# Altium schematic sheet SoC_Supply.SchDoc: RFSoC AMC
size 420 x 297 mm; CompanyName: WUT; DrawnBy: T. Przywozki; Organization: WUT ISE; Address1: Warsaw University of Technology; Address2: Nowowiejska 15/19 00-665 Warsaw; Address3: Tomasz.Przywozki@pw.edu.pl; DocumentNumber: 12; Revision: 1; SheetNumber: 12; SheetTotal: 45; Project: RFSoC AMC; ModifiedBy: T. Przywozki; CreateDate: -; CheckedDate: -; DivGrp: ISE; Designer: T. Przywozki; ModifiedDate: -; ProjectName: ADC/DAC MEZZANINE
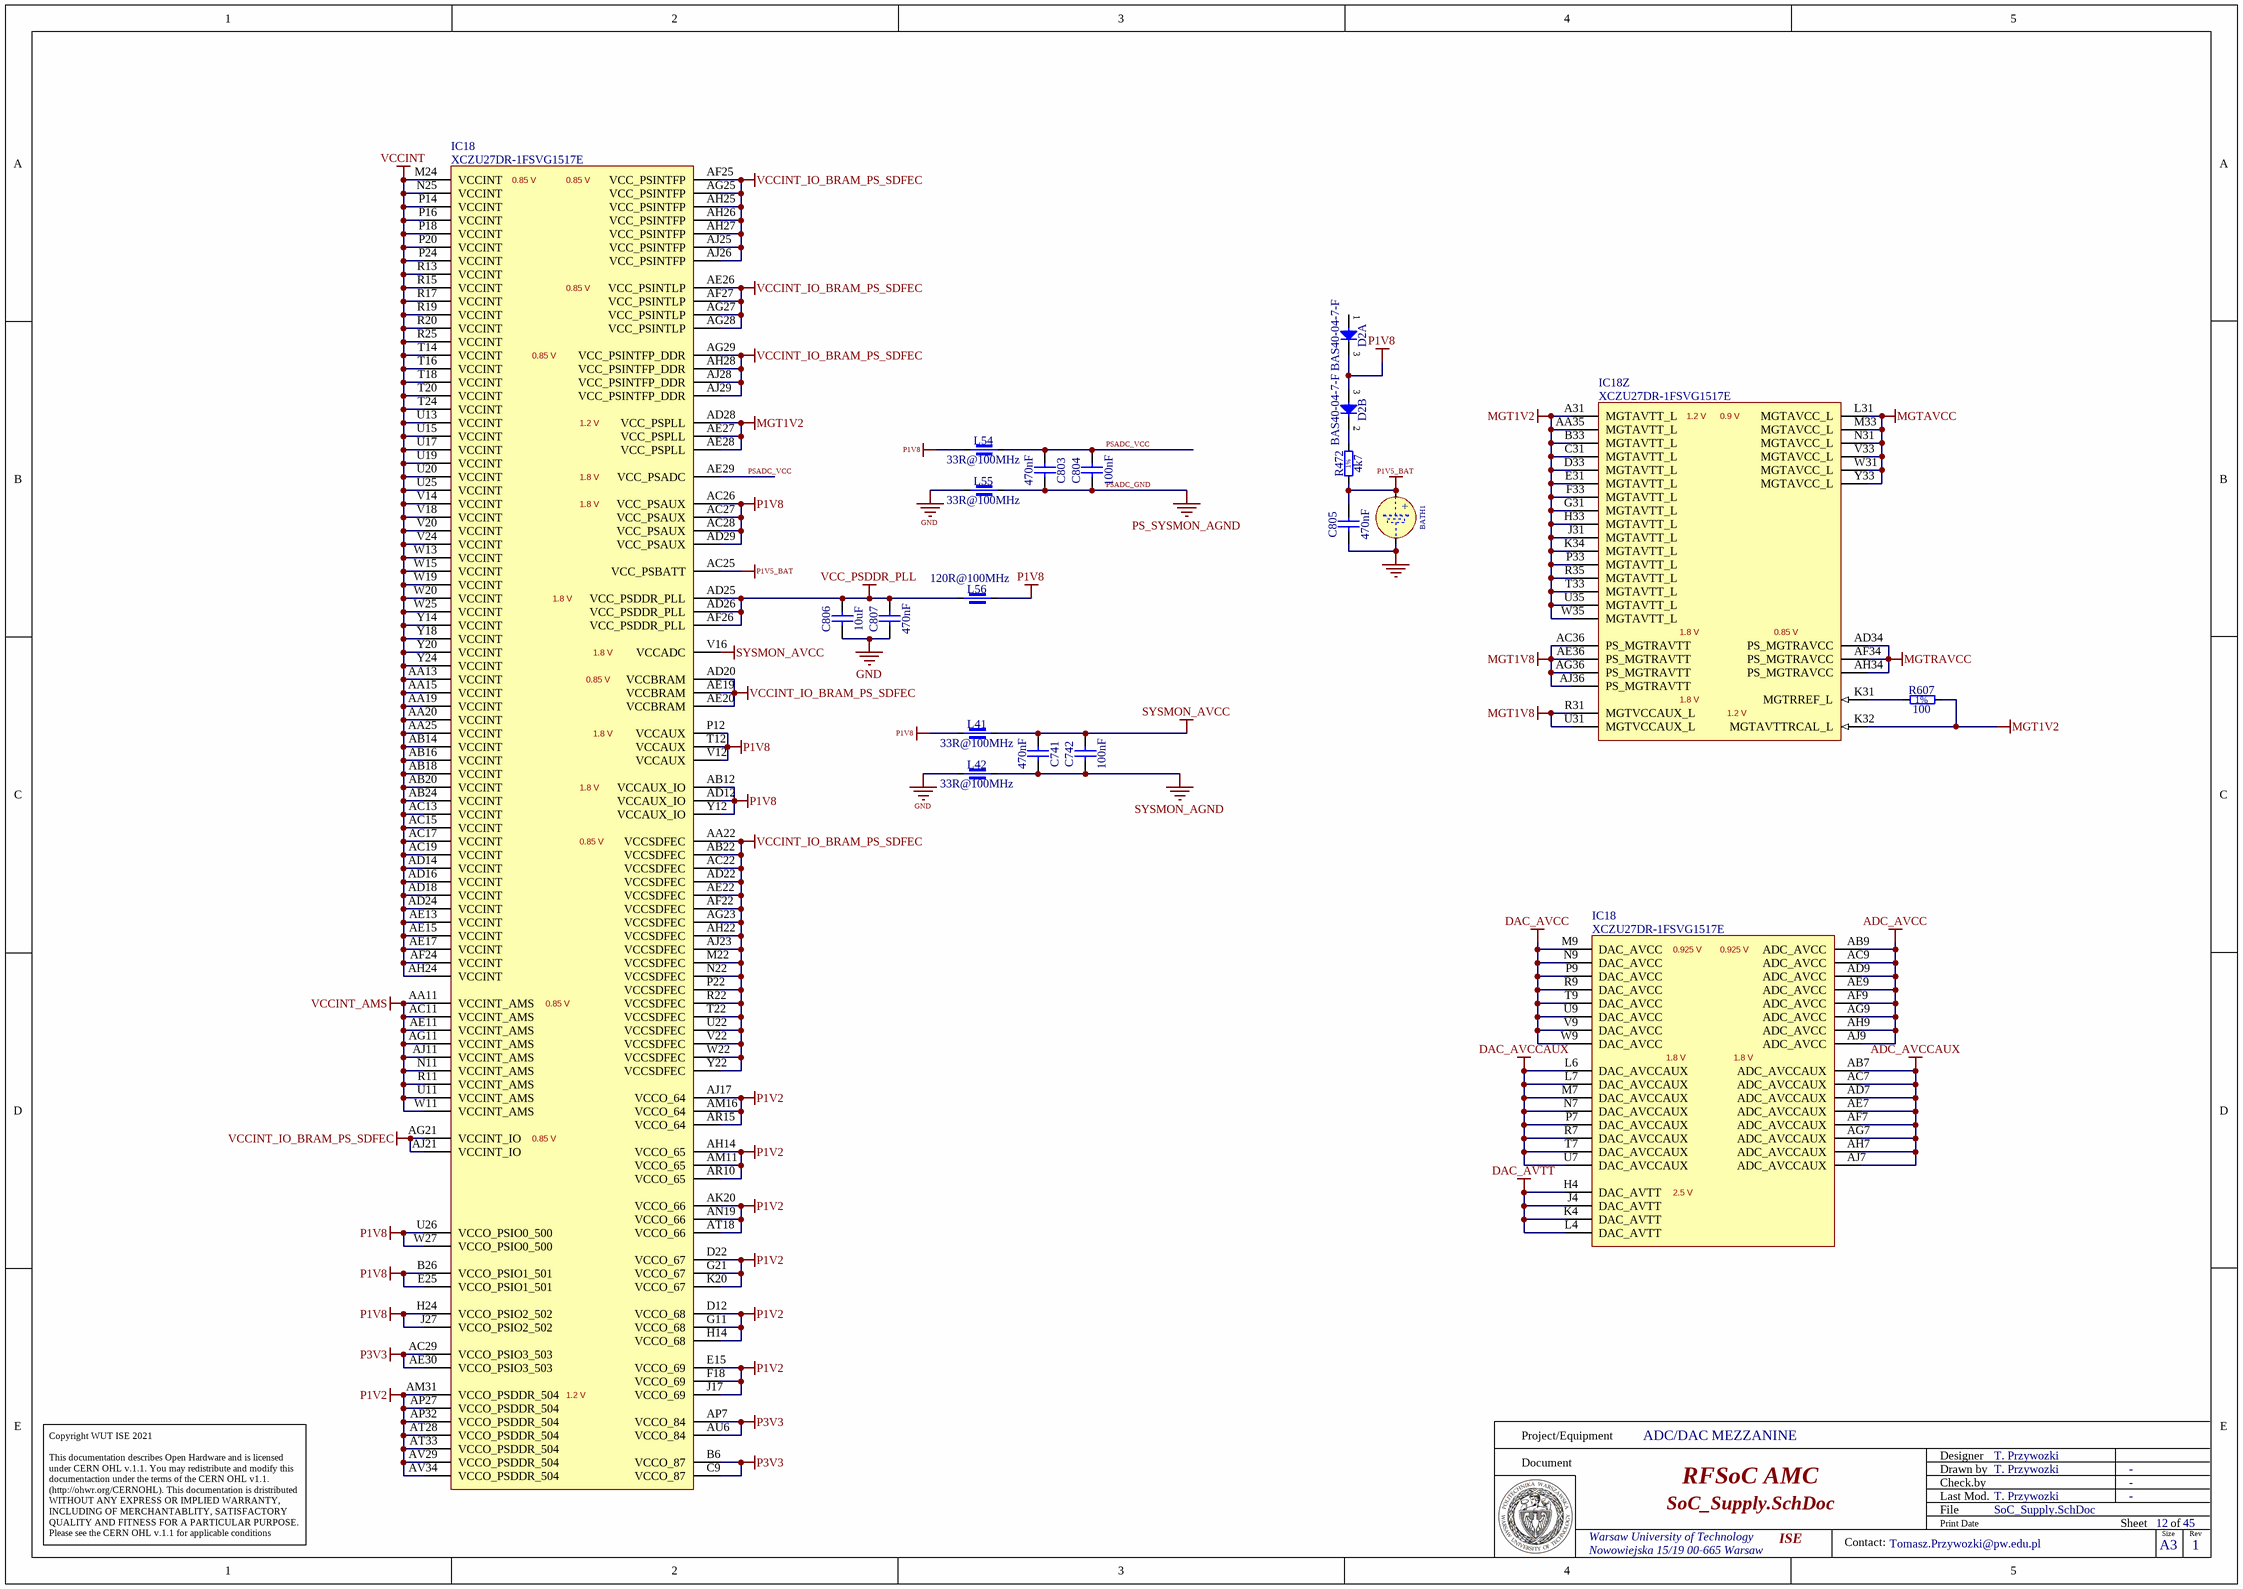
[diagram p0: SoC_Supply.SchDoc]

## Parts
BATH1  (no value)  [BATH_KEYSTONE_2998]
C741  470nF  [CAPC0603X33N]
C742  100nF  [CAPC1005X55N]
C803  470nF  [CAPC0603X33N]
C804  100nF  [CAPC1005X55N]
C805  470nF  [CAPC0603X33N]
C806  10uF  [CAPC1608X80N]
C807  470nF  [CAPC1005X55N]
D2  BAS40-04-7-F  [SOT95P240X110-3N]  (parts A,B of 2)
IC18  XCZU27DR-1FSVG1517E  [XILINX_FSVG1517 (XCZU27DR)]  (parts Z,27,28 of 31)
L41  33R@100MHz  [INDC1005X55N]
L42  33R@100MHz  [INDC1005X55N]
L54  33R@100MHz  [INDC1005X55N]
L55  33R@100MHz  [INDC1005X55N]
L56  120R@100MHz  [INDC1608X95N]
R472  4k7  [RESC1005X40N]
R607  100  [RESC1005X40N]

## Nets
ADC_AVCC: IC18.AB9(ADC_AVCC) IC18.AC9(ADC_AVCC) IC18.AD9(ADC_AVCC) IC18.AE9(ADC_AVCC) IC18.AF9(ADC_AVCC) IC18.AG9(ADC_AVCC) IC18.AH9(ADC_AVCC) IC18.AJ9(ADC_AVCC)
ADC_AVCCAUX: IC18.AB7(ADC_AVCCAUX) IC18.AC7(ADC_AVCCAUX) IC18.AD7(ADC_AVCCAUX) IC18.AE7(ADC_AVCCAUX) IC18.AF7(ADC_AVCCAUX) IC18.AG7(ADC_AVCCAUX) IC18.AH7(ADC_AVCCAUX) IC18.AJ7(ADC_AVCCAUX)
DAC_AVCC: IC18.M9(DAC_AVCC) IC18.N9(DAC_AVCC) IC18.P9(DAC_AVCC) IC18.R9(DAC_AVCC) IC18.T9(DAC_AVCC) IC18.U9(DAC_AVCC) IC18.V9(DAC_AVCC) IC18.W9(DAC_AVCC)
DAC_AVCCAUX: IC18.L6(DAC_AVCCAUX) IC18.L7(DAC_AVCCAUX) IC18.M7(DAC_AVCCAUX) IC18.N7(DAC_AVCCAUX) IC18.P7(DAC_AVCCAUX) IC18.R7(DAC_AVCCAUX) IC18.T7(DAC_AVCCAUX) IC18.U7(DAC_AVCCAUX)
DAC_AVTT: IC18.H4(DAC_AVTT) IC18.J4(DAC_AVTT) IC18.K4(DAC_AVTT) IC18.L4(DAC_AVTT)
GND: BATH1.2(MINUS) C805.1 C806.1 C807.1 L42.1 L55.1
MGT1V2: IC18.A31(MGTAVTT_L) IC18.AA35(MGTAVTT_L) IC18.AD28(VCC_PSPLL) IC18.AE27(VCC_PSPLL) IC18.AE28(VCC_PSPLL) IC18.B33(MGTAVTT_L) IC18.C31(MGTAVTT_L) IC18.D33(MGTAVTT_L) IC18.E31(MGTAVTT_L) IC18.F33(MGTAVTT_L) IC18.G31(MGTAVTT_L) IC18.H33(MGTAVTT_L) IC18.J31(MGTAVTT_L) IC18.K32(MGTAVTTRCAL_L) IC18.K34(MGTAVTT_L) IC18.P33(MGTAVTT_L) IC18.R35(MGTAVTT_L) IC18.T33(MGTAVTT_L) IC18.U35(MGTAVTT_L) IC18.W35(MGTAVTT_L) R607.2
MGT1V8: IC18.AC36(PS_MGTRAVTT) IC18.AE36(PS_MGTRAVTT) IC18.AG36(PS_MGTRAVTT) IC18.AJ36(PS_MGTRAVTT) IC18.R31(MGTVCCAUX_L) IC18.U31(MGTVCCAUX_L)
MGTAVCC: IC18.L31(MGTAVCC_L) IC18.M33(MGTAVCC_L) IC18.N31(MGTAVCC_L) IC18.V33(MGTAVCC_L) IC18.W31(MGTAVCC_L) IC18.Y33(MGTAVCC_L)
MGTRAVCC: IC18.AD34(PS_MGTRAVCC) IC18.AF34(PS_MGTRAVCC) IC18.AH34(PS_MGTRAVCC)
P1V2: IC18.AH14(VCCO_65) IC18.AJ17(VCCO_64) IC18.AK20(VCCO_66) IC18.AM11(VCCO_65) IC18.AM16(VCCO_64) IC18.AM31(VCCO_PSDDR_504) IC18.AN19(VCCO_66) IC18.AP27(VCCO_PSDDR_504) IC18.AP32(VCCO_PSDDR_504) IC18.AR10(VCCO_65) IC18.AR15(VCCO_64) IC18.AT18(VCCO_66) IC18.AT28(VCCO_PSDDR_504) IC18.AT33(VCCO_PSDDR_504) IC18.AV29(VCCO_PSDDR_504) IC18.AV34(VCCO_PSDDR_504) IC18.D12(VCCO_68) IC18.D22(VCCO_67) IC18.E15(VCCO_69) IC18.F18(VCCO_69) IC18.G11(VCCO_68) IC18.G21(VCCO_67) IC18.H14(VCCO_68) IC18.J17(VCCO_69) IC18.K20(VCCO_67)
P1V5_BAT: BATH1.1(PLUS) C805.2 IC18.AC25(VCC_PSBATT) R472.1
P1V8: D2.3(COMAC) IC18.AB12(VCCAUX_IO) IC18.AC26(VCC_PSAUX) IC18.AC27(VCC_PSAUX) IC18.AC28(VCC_PSAUX) IC18.AD12(VCCAUX_IO) IC18.AD29(VCC_PSAUX) IC18.B26(VCCO_PSIO1_501) IC18.E25(VCCO_PSIO1_501) IC18.H24(VCCO_PSIO2_502) IC18.J27(VCCO_PSIO2_502) IC18.P12(VCCAUX) IC18.T12(VCCAUX) IC18.U26(VCCO_PSIO0_500) IC18.V12(VCCAUX) IC18.W27(VCCO_PSIO0_500) IC18.Y12(VCCAUX_IO) L41.1 L54.1 L56.1
P3V3: IC18.AC29(VCCO_PSIO3_503) IC18.AE30(VCCO_PSIO3_503) IC18.AP7(VCCO_84) IC18.AU6(VCCO_84) IC18.B6(VCCO_87) IC18.C9(VCCO_87)
PSADC_GND: C803.1 C804.1 L55.2  [also labelled PS_SYSMON_AGND]
SYSMON_AGND: C741.1 C742.1 L42.2
SYSMON_AVCC: C741.2 C742.2 IC18.V16(VCCADC) L41.2
VCC_PSDDR_PLL: C806.2 C807.2 IC18.AD25(VCC_PSDDR_PLL) IC18.AD26(VCC_PSDDR_PLL) IC18.AF26(VCC_PSDDR_PLL) L56.2
VCCINT: IC18.AA13(VCCINT) IC18.AA15(VCCINT) IC18.AA19(VCCINT) IC18.AA20(VCCINT) IC18.AA25(VCCINT) IC18.AB14(VCCINT) IC18.AB16(VCCINT) IC18.AB18(VCCINT) IC18.AB20(VCCINT) IC18.AB24(VCCINT) IC18.AC13(VCCINT) IC18.AC15(VCCINT) IC18.AC17(VCCINT) IC18.AC19(VCCINT) IC18.AD14(VCCINT) IC18.AD16(VCCINT) IC18.AD18(VCCINT) IC18.AD24(VCCINT) IC18.AE13(VCCINT) IC18.AE15(VCCINT) IC18.AE17(VCCINT) IC18.AF24(VCCINT) IC18.AH24(VCCINT) IC18.M24(VCCINT) IC18.N25(VCCINT) IC18.P14(VCCINT) IC18.P16(VCCINT) IC18.P18(VCCINT) IC18.P20(VCCINT) IC18.P24(VCCINT) IC18.R13(VCCINT) IC18.R15(VCCINT) IC18.R17(VCCINT) IC18.R19(VCCINT) IC18.R20(VCCINT) IC18.R25(VCCINT) IC18.T14(VCCINT) IC18.T16(VCCINT) IC18.T18(VCCINT) IC18.T20(VCCINT) IC18.T24(VCCINT) IC18.U13(VCCINT) IC18.U15(VCCINT) IC18.U17(VCCINT) IC18.U19(VCCINT) IC18.U20(VCCINT) IC18.U25(VCCINT) IC18.V14(VCCINT) IC18.V18(VCCINT) IC18.V20(VCCINT) IC18.V24(VCCINT) IC18.W13(VCCINT) IC18.W15(VCCINT) IC18.W19(VCCINT) IC18.W20(VCCINT) IC18.W25(VCCINT) IC18.Y14(VCCINT) IC18.Y18(VCCINT) IC18.Y20(VCCINT) IC18.Y24(VCCINT)
VCCINT_AMS: IC18.AA11(VCCINT_AMS) IC18.AC11(VCCINT_AMS) IC18.AE11(VCCINT_AMS) IC18.AG11(VCCINT_AMS) IC18.AJ11(VCCINT_AMS) IC18.N11(VCCINT_AMS) IC18.R11(VCCINT_AMS) IC18.U11(VCCINT_AMS) IC18.W11(VCCINT_AMS)
VCCINT_IO_BRAM_PS_SDFEC: IC18.AA22(VCCSDFEC) IC18.AB22(VCCSDFEC) IC18.AC22(VCCSDFEC) IC18.AD20(VCCBRAM) IC18.AD22(VCCSDFEC) IC18.AE19(VCCBRAM) IC18.AE20(VCCBRAM) IC18.AE22(VCCSDFEC) IC18.AE26(VCC_PSINTLP) IC18.AF22(VCCSDFEC) IC18.AF25(VCC_PSINTFP) IC18.AF27(VCC_PSINTLP) IC18.AG21(VCCINT_IO) IC18.AG23(VCCSDFEC) IC18.AG25(VCC_PSINTFP) IC18.AG27(VCC_PSINTLP) IC18.AG28(VCC_PSINTLP) IC18.AG29(VCC_PSINTFP_DDR) IC18.AH22(VCCSDFEC) IC18.AH25(VCC_PSINTFP) IC18.AH26(VCC_PSINTFP) IC18.AH27(VCC_PSINTFP) IC18.AH28(VCC_PSINTFP_DDR) IC18.AJ21(VCCINT_IO) IC18.AJ23(VCCSDFEC) IC18.AJ25(VCC_PSINTFP) IC18.AJ26(VCC_PSINTFP) IC18.AJ28(VCC_PSINTFP_DDR) IC18.AJ29(VCC_PSINTFP_DDR) IC18.M22(VCCSDFEC) IC18.N22(VCCSDFEC) IC18.P22(VCCSDFEC) IC18.R22(VCCSDFEC) IC18.T22(VCCSDFEC) IC18.U22(VCCSDFEC) IC18.V22(VCCSDFEC) IC18.W22(VCCSDFEC) IC18.Y22(VCCSDFEC)
PSADC_VCC: C803.2 C804.2 IC18.AE29(VCC_PSADC) L54.2
NetD2_2: D2.2(C) R472.2
NetIC18_K31: IC18.K31(MGTRREF_L) R607.1

Not connected (* = marked no-connect by the designer): D2 1(A)

## Notes on the sheet
- (near IC18) 0.85 V
- (near IC18) 1.2 V
- (near IC18) 0.9 V
- (near IC18) 1.8 V
- (near IC18) 0.925 V
- (near IC18) 2.5 V
- Project/Equipment
- Document
- Designer
- Drawn by
- Check.by
- Copyright WUT ISE 2021
  This documentation describes Open Hardware and is licensed under CERN OHL v.1.1. You may redistribute and modify this documentaction under the terms of the CERN OHL v1.1.
  (http://ohwr.org/CERNOHL). This documentation is dristributed WITHOUT ANY EXPRESS OR IMPLIED WARRANTY, INCLUDING OF MERCHANTABLITY, SATISFACTORY QUALITY AND FITNESS FOR A PARTICULAR PURPOSE. Please see the CERN OHL v.1.1 for applicable conditions
- File
- Last Mod.
- Print Date
- Sheet
- Size
- A3
- of
- Rev
- Contact:
- (in symbol BATH_KEYSTONE_2998) +
- (in symbol R0402_4K7_1%_0.0625W_100PPM) 1%
- (in symbol R0402_100R_1%_0.1W_100PPM) 1%

## Library data of the parts
BATH1 = BATH_KEYSTONE_2998: Battery Holder whit 2 Pin; Part Description: SMD Battery Holder for MC621, V364, SC621, DR13H, DR77, V13AT, 377 Button Cells; Manufacturer Part Number: 2998; PressFit: No; Part Number: BATH_KEYSTONE_2998; Component Kind: Standard; Component Type: Standard; Pin Count: 3; PackageDescription: SMD Battery Holder for MC621, V364, SC621, DR13H, DR77, V13AT, 377 Button Cells; Family: Battery; Mounted: Yes; Socket: No; SMD: Yes; Sense: No; Manufacturer: KEYSTONE; ComponentHeight: 3.048mm; HelpURL: \\cern.ch\dfs\Applications\Altium\Datasheets\BATH_KEYSTONE_2998.pdf; Author: CERN DEM JLC; CreateDate: 03.07.2014; LatestRevisionDate: 07.06.2017
C741 C803 C805 = CC0201_470NF_4V_20%_X5R: Non-polarised capacitor; Manufacturer: GENERIC; Part Description: SMD Multilayer Chip Ceramic Capacitor; Manufacturer1 Part Number: AMK063BJ474MP-F; Tolerance: ±20%; Voltage: 4V; TC: X5R; Manufacturer Part Number: CC0201_470NF_4V_20%_X5R; Part Number: CC0201_470NF_4V_20%_X5R; Value: 470nF; Component Kind: Standard; Component Type: Standard; Pin Count: 2; Status: Not Recommended; Case: 0201; Mounted: Yes; Socket: No; SMD: Yes; Sense: No; Manufacturer1 Example: TAIYO YUDEN; Manufacturer1 ComponentHeight: 0.33mm; HelpURL: \\cern.ch\dfs\Applications\Altium\Datasheets\CC0201_X5R_TAIYO-YUDEN_STANDARD-CLASS2.pdf; Author: CERN DEM JLC; CreateDate: 27.05.2010; LatestRevisionDate: 27.05.2010
C742 C804 = CC0402_100NF_25V_10%_X7R_YUDEN_TMK105B7104KVHF: Non-polarised capacitor; Part Description: SMD Multilayer Chip Ceramic Capacitor (High Dielectric Type) for Automotive / Industrial Applications; Manufacturer: TAIYO YUDEN; Voltage: 25V; TC: X7R; Tolerance: ±10%; Part Number: CC0402_100NF_25V_10%_X7R_YUDEN_TMK105B7104KVHF; Component Kind: Standard; Component Type: Standard; Pin Count: 2; Value: 100nF; Status: Not Recommended; Manufacturer Part Number: TMK105B7104KVHF; Case: 0402; Mounted: Yes; Socket: No; SMD: Yes; Sense: No; ComponentHeight: 0.55mm; HelpURL: \\cern.ch\dfs\Applications\Altium\Datasheets\CC0402_TAIYO-YUDEN_TMK105B7104KVHF.pdf; Author: CERN DEM JLC; CreateDate: 10.05.2017; LatestRevisionDate: 10.05.2017
C806 = CC0603_10UF_10V_10%_X5R: Non-polarised capacitor; Part Description: SMD Multilayer Chip Ceramic Capacitor; Manufacturer: GENERIC; Manufacturer1 Part Number: GRM188R61A106KE69D; Voltage: 10V; TC: X5R; Tolerance: ±10%; Part Number: CC0603_10UF_10V_10%_X5R; Component Kind: Standard; Component Type: Standard; Pin Count: 2; Value: 10uF; Status: None; Manufacturer Part Number: CC0603_10UF_10V_10%_X5R; Case: 0603; Mounted: Yes; Socket: No; SMD: Yes; Sense: No; Manufacturer1 Example: MURATA; Manufacturer1 ComponentHeight: 0.8mm; HelpURL: \\cern.ch\dfs\Applications\Altium\Datasheets\CC0603_MURATA_GRM188R61A106KE69D.pdf; Author: CERN DEM JLC; CreateDate: 31.01.2017; LatestRevisionDate: 31.01.2017
C807 = CC0402_470NF_16V_10%_X5R: Non-polarised capacitor; Part Description: SMD Multilayer Chip Ceramic Capacitor; Manufacturer: GENERIC; Manufacturer1 Part Number: C1005X5R1C105KT; Voltage: 16V; TC: X5R; Tolerance: ±10%; Part Number: CC0402_470NF_16V_10%_X5R; Component Kind: Standard; Component Type: Standard; Pin Count: 2; Value: 470nF; Status: Preferred; Manufacturer Part Number: CC0402_470NF_16V_10%_X5R; Case: 0402; Mounted: Yes; Socket: No; SMD: Yes; Sense: No; Manufacturer1 Example: TDK; Manufacturer1 ComponentHeight: 0.55mm; HelpURL: \\cern.ch\dfs\Applications\Altium\Datasheets\CC0402_X5R_TDK_C.pdf; Author: CERN DEM JLC; CreateDate: 25.10.2012; LatestRevisionDate: 25.10.2012
D2 = BAS40-04-7-F: Serial Diode; Part Description: Dual Series Surface Mount Schottky Barrier Diodes; Manufacturer: DIODES INCORPORATED; Voltage: 40V; Power: 200mA; PressFit: No; Bonding: No; Part Number: BAS40-04-7-F; Component Kind: Standard; Component Type: Standard; Device: BAS40-04-7-F; PackageDescription: SOT, 0.95mm Pitch; 3 Pin, 1.30mm W X 2.90mm L X 1.10mm H, IPC Medium Density; Manufacturer Part Number: BAS40-04-7-F; Pin Count: 3; Case: SOT23-3; Mounted: Yes; Socket: No; SMD: Yes; Sense: No; ComponentHeight: 1.1mm; HelpURL: \\cern.ch\dfs\Applications\Altium\Datasheets\BAS40-04-7-F.pdf; Author: CERN DEM JLC; CreateDate: 07.07.2014; LatestRevisionDate: 07.07.2014
IC18 = XCZU27DR-1FSVG1517E: Zynq UltraScale+ RFSoC, Quad-Core ARM® Cortex™-A53 MPCore™ up to 1.5GHz, 214 PS I/O, 299 HP I/O, 48 HD I/O, 1517-Pin BGA; Manufacturer: XILINX; PressFit: No; Bonding: No; Part Number: XCZU27DR-1FSVG1517E; Component Kind: Standard; Component Type: Standard; Device: XCZU27DR-1FSVG1517E; PackageDescription: BGA, 1.00mm Pitch, Square; 1517 Pin, 39 Columns X 39 Rows, 40.00mm X 40.00mm X 4.01mm H; Part Description: Zynq UltraScale+ RFSoC, Quad-Core ARM® Cortex™-A53 MPCore™ up to 1.5GHz, 214 PS I/O, 299 HP I/O, 48 HD I/O, 1517-Pin BGA; Manufacturer Part Number: XCZU27DR-1FSVG1517E; Pin Count: 1517; Case: BGA1517; Mounted: Yes; Socket: No; SMD: Yes; Sense: No; ComponentHeight: 4.01mm; HelpURL: \\cern.ch\dfs\Applications\Altium\Datasheets\XCZU27DR-1FSVG1517E.pdf; ComponentLink1URL: \\cern.ch\dfs\Applications\Altium\Datasheets\XCZU27DR-1FSVG1517E_Package-Pinout.pdf; ComponentLink1Description: Package/Pinout; ComponentLink2URL: \\cern.ch\dfs\Applications\Altium\Datasheets\XCZU27DR-1FSVG1517E_Pinout.pdf; ComponentLink2Description: Pinout; Author: CERN DEM MR; CreateDate: 02/05/2018; LatestRevisionDate: 02/05/2018
L41 L42 L54 L55 = IND0402_MURATA_BLM15PX330SN1D: Manufacturer: MURATA; Part Description: SMD EMIFIL Chip Ferrite Bead; Tolerance: ±25%; Power: 3A; Resistance: 0.022R; Manufacturer Part Number: BLM15PX330SN1D; Part Number: IND0402_MURATA_BLM15PX330SN1D; Value: 33R@100MHz; Component Kind: Standard; Component Type: Standard; Pin Count: 2; Status: None; Case: 0402; Mounted: Yes; Socket: No; SMD: Yes; Sense: No; ComponentHeight: 0.55mm; HelpURL: \\cern.ch\dfs\Applications\Altium\Datasheets\IND0402_MURATA_BLM15PX.pdf; Author: CERN DEM JMW; CreateDate: 19.02.2014; LatestRevisionDate: 25.10.2018
L56 = IND0603_MURATA_BLM18PG121SN1D: Manufacturer: MURATA; Part Description: SMD EMIFIL Chip Ferrite Bead; Power: 2A; Resistance: 0.05R; Manufacturer Part Number: BLM18PG121SN1D; Part Number: IND0603_MURATA_BLM18PG121SN1D; Value: 120R@100MHz; Component Kind: Standard; Component Type: Standard; Pin Count: 2; Status: None; Case: 0603; Mounted: Yes; Socket: No; SMD: Yes; Sense: No; ComponentHeight: 0.95mm; HelpURL: \\cern.ch\dfs\Applications\Altium\Datasheets\IND0603_MURATA_BLM18P.pdf; Author: CERN DEM BC; CreateDate: 27.07.2015; LatestRevisionDate: 25.10.2018
R472 = R0402_4K7_1%_0.0625W_100PPM: Resistor - 1%; Part Description: General Purpose Thick Film Chip Resistor; Manufacturer: GENERIC; Manufacturer1 Part Number: 232270674702L; TC: ±100ppm/°C; PressFit: No; Part Number: R0402_4K7_1%_0.0625W_100PPM; Component Kind: Standard; Component Type: Standard; Pin Count: 2; Value: 4k7; Status: Not Recommended; Power: 0.0625W; Tolerance: ±1%; Manufacturer Part Number: R0402_4K7_1%_0.0625W_100PPM; Case: 0402; Mounted: Yes; Sense: No; Socket: No; SMD: Yes; Manufacturer1 Example: YAGEO PHYCOMP; Manufacturer1 ComponentHeight: 0.4mm; HelpURL: \\cern.ch\dfs\Applications\Altium\Datasheets\R0402_Phycomp_RC0402.pdf; Author: CERN DEM JLC; CreateDate: 03.12.2007; LatestRevisionDate: 17.10.2012
R607 = R0402_100R_1%_0.1W_100PPM: Resistor - 1%; Part Description: General Purpose Thick Film Chip Resistor; Manufacturer: GENERIC; Manufacturer Part Number: R0402_100R_1%_0.1W_100PPM_50V; Manufacturer1 Part Number: ERJ2RKF1000X; Power: 0.1W; TC: ±100ppm/°C; Voltage: 50V; PressFit: No; Part Number: R0402_100R_1%_0.1W_100PPM; Component Kind: Standard; Component Type: Standard; Pin Count: 2; Value: 100; Status: Not Recommended; Tolerance: ±1%; Case: 0402; Mounted: Yes; Sense: No; Socket: No; SMD: Yes; Manufacturer1 Example: PANASONIC; Manufacturer1 ComponentHeight: 0.4mm; HelpURL: \\cern.ch\dfs\Applications\Altium\Datasheets\R0402_PANASONIC_ERJ2RK.pdf; Author: CERN DEM JLC; CreateDate: 12.12.2013; LatestRevisionDate: 03.03.2015